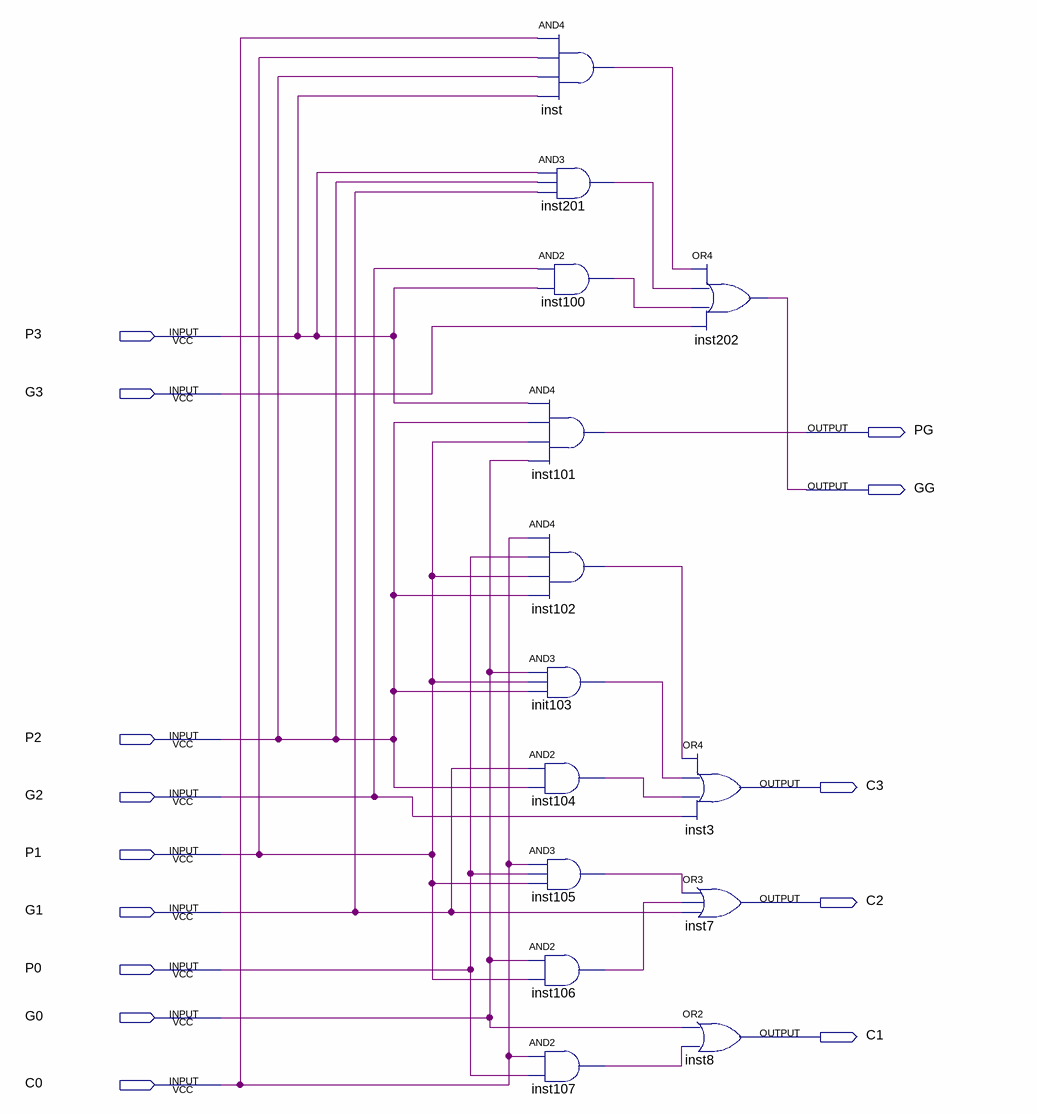
[diagram p0: schematic sheet]
// Quartus schematic LAC.bdf as structural Verilog: 14 symbols, 14 pins
module LAC (
  input  P3,
  input  G3,
  input  P2,
  input  G2,
  input  P1,
  input  G1,
  input  P0,
  input  G0,
  input  C0,
  output PG,
  output GG,
  output C3,
  output C2,
  output C1
);

  wire init103_out, inst100_out, inst102_out, inst104_out, inst105_out, inst106_out, inst107_out,
       inst201_out, inst_out;

  and inst (inst_out, C0, P1, P2, P3);
  and inst201 (inst201_out, P3, P2, G1);
  and inst100 (inst100_out, G2, P3);
  and inst101 (PG, P3, P2, P1, G0);
  and inst102 (inst102_out, C0, P0, P1, P2);
  and init103 (init103_out, G0, P1, P2);
  and inst104 (inst104_out, G1, P2);
  and inst105 (inst105_out, C0, P0, P1);
  and inst106 (inst106_out, G0, P1);
  and inst107 (inst107_out, C0, P0);
  or inst202 (GG, inst_out, inst201_out, inst100_out, G3);
  or inst3 (C3, inst102_out, init103_out, inst104_out, G2);
  or inst7 (C2, inst105_out, inst106_out, G1);
  or inst8 (C1, G0, inst107_out);
endmodule
